# Altium schematic sheet Sheet1.SchDoc
size A4; SheetNumber: 1; SheetTotal: 1
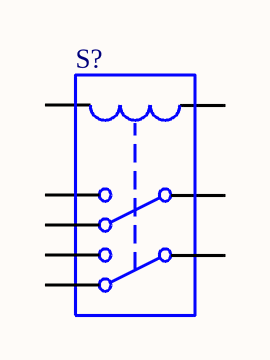
[diagram p0: Sheet1.SchDoc]

## Parts
S?  Doubl-Pole, Double-Throw Relay  (value not drawn)

## Nets

Not connected (* = marked no-connect by the designer): S? 1 2 3 4 5 6 7 8

## Library data of the parts
S? = DPDT Relay: L_C: 1u; R_C: 100; RON: 1; ROFF: 1e12; ION: 1m; IOFF: 0; SimulationGenericComponent: True